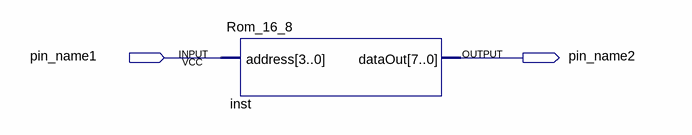
[diagram p0: schematic sheet]
// Quartus schematic ROM_Demo-bdf.bdf as structural Verilog: 1 symbols, 2 pins
module \ROM_Demo-bdf  (
  input  pin_name1,
  output pin_name2
);

  Rom_16_8 inst (.dataOut(pin_name2));  // open: address
endmodule
